# EAGLE design ATtiny LED badge (EAGLE 8.4.3)
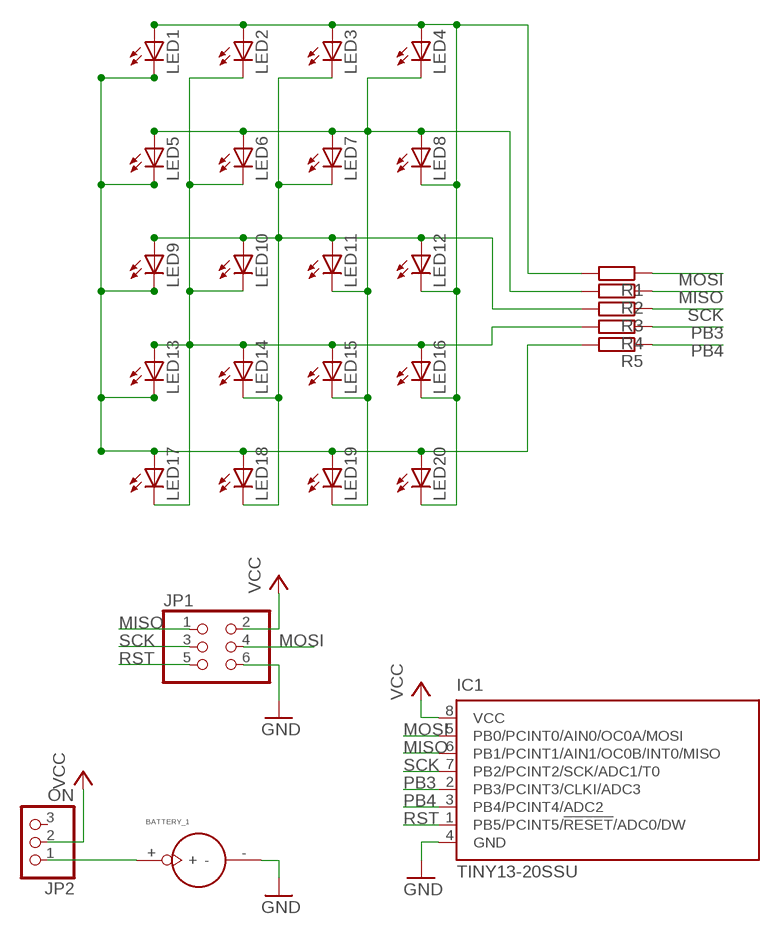
[diagram p0: schematic, sheet 1]

## Parts
BATTERY_1  BATTERY_1236_C  [BATTERY_1236_C]
IC1  TINY13-20SSU  [8S1]
JP1  PINHD-2X3  [2X03]
JP2  ON  PINHD-1X3  [1X03]
LED1  LED3MM  [LED3MM]
LED2  LED3MM  [LED3MM]
LED3  LED3MM  [LED3MM]
LED4  LED3MM  [LED3MM]
LED5  LED3MM  [LED3MM]
LED6  LED3MM  [LED3MM]
LED7  LED3MM  [LED3MM]
LED8  LED3MM  [LED3MM]
LED9  LED3MM  [LED3MM]
LED10  LED3MM  [LED3MM]
LED11  LED3MM  [LED3MM]
LED12  LED3MM  [LED3MM]
LED13  LED3MM  [LED3MM]
LED14  LED3MM  [LED3MM]
LED15  LED3MM  [LED3MM]
LED16  LED3MM  [LED3MM]
LED17  LED3MM  [LED3MM]
LED18  LED3MM  [LED3MM]
LED19  LED3MM  [LED3MM]
LED20  LED3MM  [LED3MM]
R1  R-EU_0207/7  [0207/7]
R2  R-EU_0207/7  [0207/7]
R3  R-EU_0207/7  [0207/7]
R4  R-EU_0207/7  [0207/7]
R5  R-EU_0207/7  [0207/7]

## Nets
GND: BATTERY_1.- IC1.4(GND) JP1.6
MISO: IC1.6(PB1/PCINT1/AIN1/OC0B/INT0/MISO) JP1.1 R2.1
MOSI: IC1.5(PB0/PCINT0/AIN0/OC0A/MOSI) JP1.4 R1.1
N$1: LED1.A LED2.A LED3.A LED4.A LED8.K(C) LED12.K(C) LED16.K(C) LED20.K(C) R1.2
N$2: LED4.K(C) LED5.A LED6.A LED7.A LED8.A LED11.K(C) LED15.K(C) LED19.K(C) R2.2
N$3: LED3.K(C) LED7.K(C) LED9.A LED10.A LED11.A LED12.A LED14.K(C) LED18.K(C) R3.2
N$4: LED2.K(C) LED6.K(C) LED10.K(C) LED13.A LED14.A LED15.A LED16.A LED17.K(C) R4.2
N$5: LED1.K(C) LED5.K(C) LED9.K(C) LED13.K(C) LED17.A LED18.A LED19.A LED20.A R5.2
N$6: BATTERY_1.+ JP2.1
PB3: IC1.2(PB3/PCINT3/CLKI/ADC3) R4.1
PB4: IC1.3(PB4/PCINT4/ADC2) R5.1
RST: IC1.1(PB5/PCINT5/!RESET!/ADC0/DW) JP1.5
SCK: IC1.7(PB2/PCINT2/SCK/ADC1/T0) JP1.3 R3.1
VCC: IC1.8(VCC) JP1.2 JP2.2
Unconnected: JP2.3

## Library data of the parts
BATTERY_1 = Itead_BP_110825.lbr:BATTERY_1236_C: SOC004
IC1 = atmel:TINY13: 8-bit AVR Microcontroller with 1K Bytes In-System Programmable Flash Source: http://www.atmel.com/dyn/resources/prod_documents/2535S.pdf; MPN: ATTINY13-20SSU; OC_FARNELL: 1455133; OC_NEWARK: 58M3771
JP1 = pinhead:PINHD-2X3: PIN HEADER
JP2 = pinhead:PINHD-1X3: PIN HEADER
LED1-LED20 = led:LED: LED OSRAM: - CHIPLED LG R971, LG N971, LY N971, LG Q971, LY Q971, LO R971, LY R971 LH N974, LH R974 LS Q976, LO Q976, LY Q976 LO Q996 - Hyper CHIPLED LW Q18S LB Q993, LB Q99A, LB R99A - SideLED LS A670, LO A670, LY A670, LG A670, LP A670 LB A673, LV A673, LT A673, LW A673 LH A674 LY A675 LS A676, LA A676, LO A676, LY A676, LW A676 LS A679, LY A679, LG A679 - Hyper Micro SIDELED® LS Y876, LA Y876, LO Y876, LY Y876 LT Y87S - SmartLED LW L88C, LW L88S LB L89C, LB L89S, LG L890 LS L89K, LO L89K, LY L89K LS L896, LA L896, LO L896, LY L896 - TOPLED LS T670, LO T670, LY T670, LG T670, LP T670 LSG T670, LSP T670, LSY T670, LOP T670, LYG T670 LG T671, LOG T671, LSG T671 LB T673, LV T673, LT T673, LW T673 LH T674 LS T676, LA T676, LO T676, LY T676, LB T676, LH T676, LSB T676, LW T676 LB T67C, LV T67C, LT T67C, LS T67K, LO T67K, LY T67K, LW E67C LS E67B, LA E67B, LO E67B, LY E67B, LB E67C, LV E67C, LT E67C LW T67C LS T679, LY T679, LG T679 LS T770, LO T770, LY T770, LG T770, LP T770 LB T773, LV T773, LT T773, LW T773 LH T774 LS E675, LA E675, LY E675, LS T675 LS T776, LA T776, LO T776, LY T776, LB T776 LHGB T686 LT T68C, LB T68C - Hyper Mini TOPLED® LB M676 - Mini TOPLED Santana® LG M470 LS M47K, LO M47K, LY M47K Source: http://www.osram.convergy.de LUXEON: - LUMILED® LXK2-PW12-R00, LXK2-PW12-S00, LXK2-PW14-U00, LXK2-PW14-V00 LXK2-PM12-R00, LXK2-PM12-S00, LXK2-PM14-U00 LXK2-PE12-Q00, LXK2-PE12-R00, LXK2-PE12-S00, LXK2-PE14-T00, LXK2-PE14-U00 LXK2-PB12-K00, LXK2-PB12-L00, LXK2-PB12-M00, LXK2-PB14-N00, LXK2-PB14-P00, LXK2-PB14-Q00 LXK2-PR12-L00, LXK2-PR12-M00, LXK2-PR14-Q00, LXK2-PR14-R00 LXK2-PD12-Q00, LXK2-PD12-R00, LXK2-PD12-S00 LXK2-PH12-R00, LXK2-PH12-S00 LXK2-PL12-P00, LXK2-PL12-Q00, LXK2-PL12-R00 Source: www.luxeon.com KINGBRIGHT: KA-3528ASYC Source: www.kingbright.com
R1-R5 = resistor:R-EU_: RESISTOR, European symbol

## Board
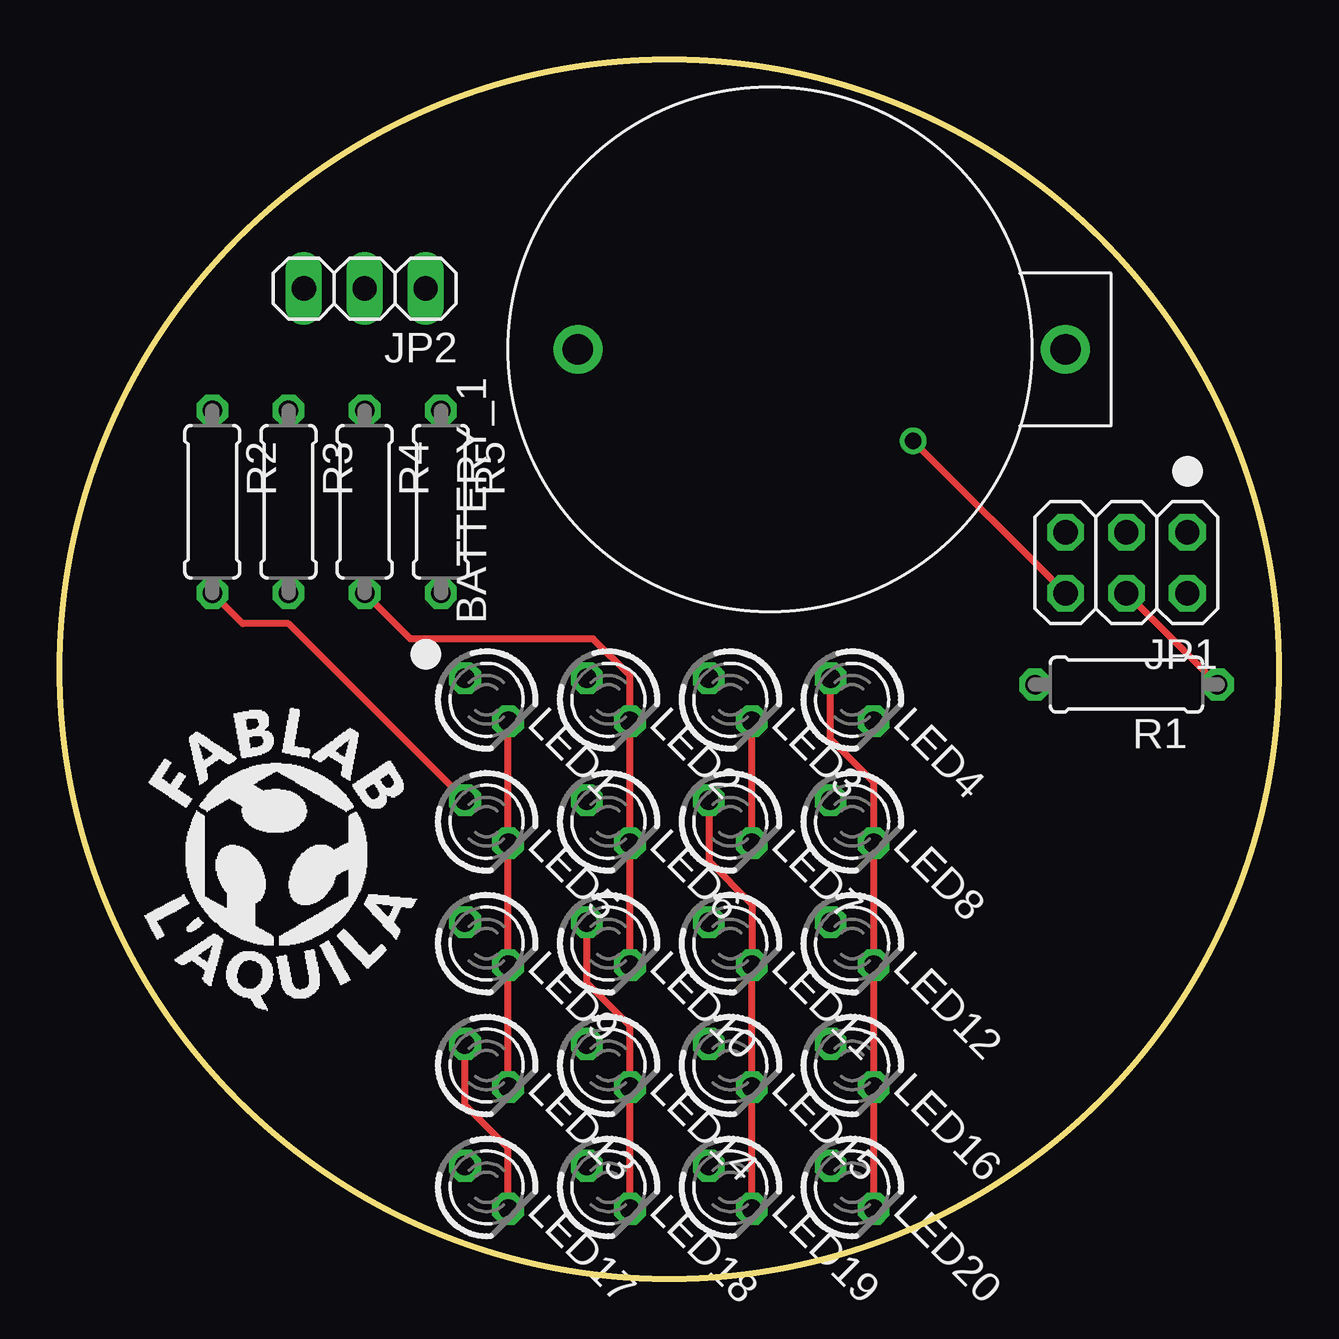
[diagram p1: board, top side]
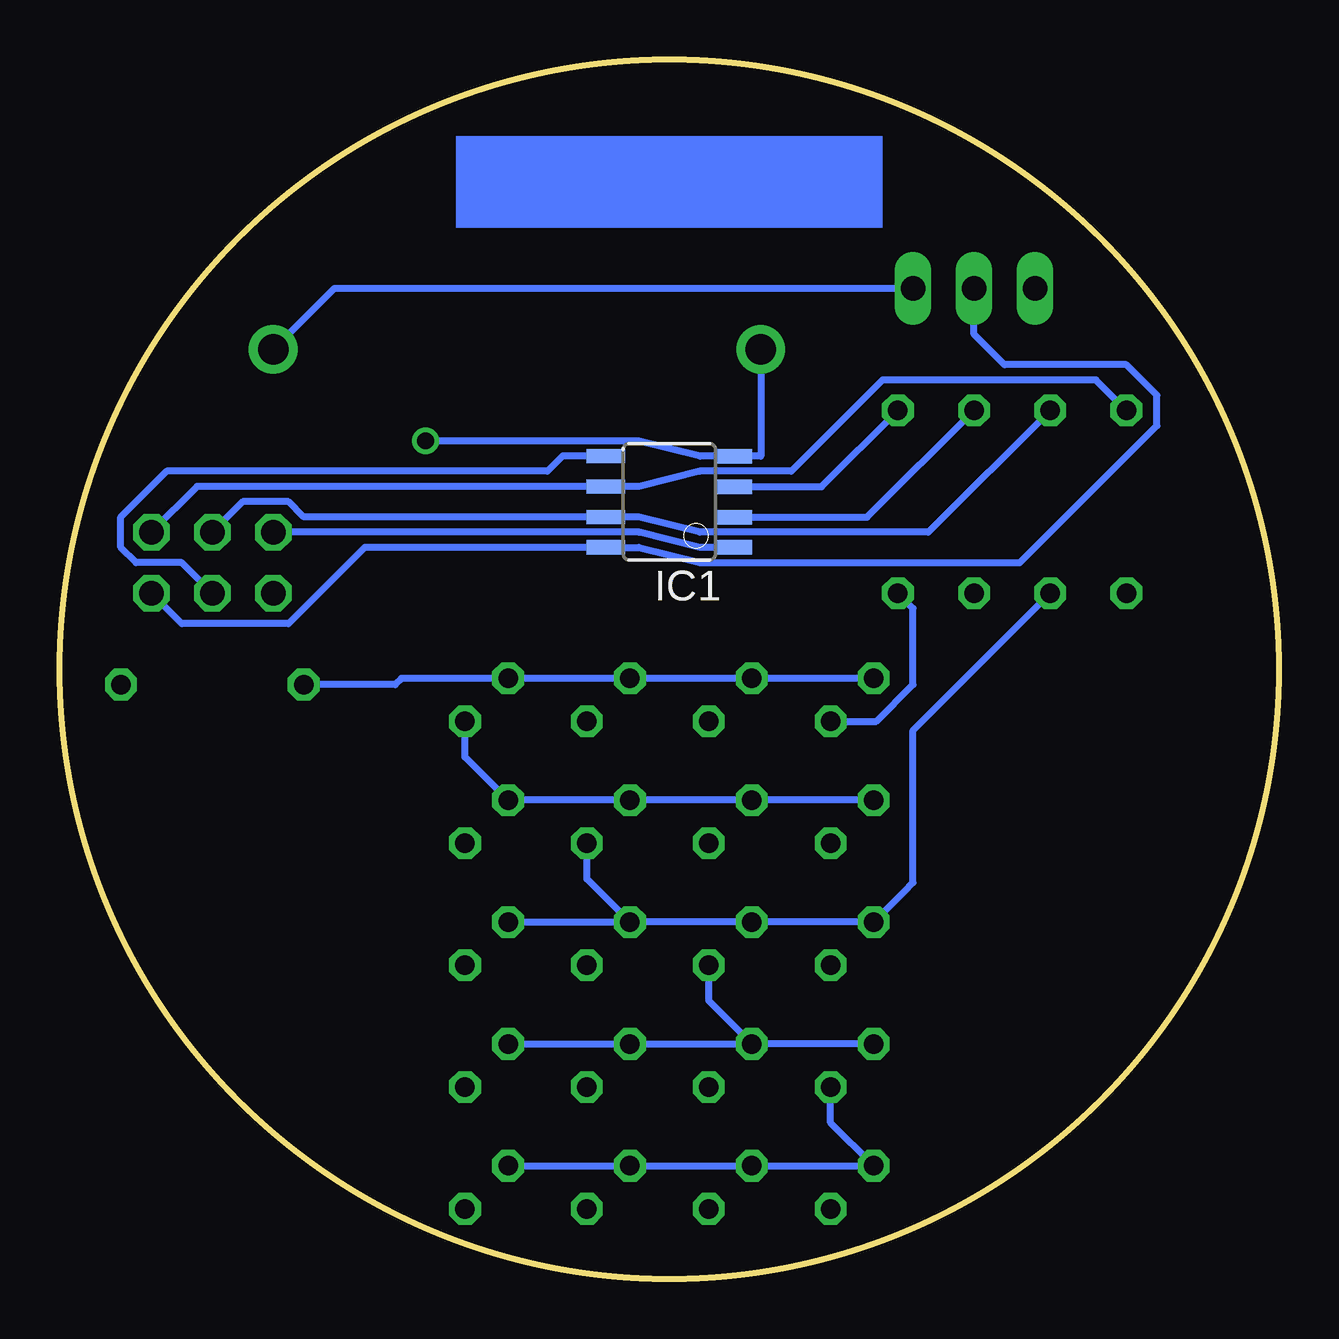
[diagram p2: board, bottom side, seen from below]

Size 50.8 x 50.8 mm. Coordinates in mm from the lower left corner, seen from the top.
Outline: circle at 25.4,25.4 radius 25.4
Copper layers (1*16): Top 0.035mm / dielectric 1.5mm / Bottom 0.035mm
Design rules "default": minimum track width 10mil, minimum drill 24mil, track to track 8mil, track to pad 8mil, pad to pad 8mil, via to via 8mil, smd to smd 8mil, copper to edge 40mil, drill to drill 8mil, minimum pad ring 10mil, minimum via ring 8mil, stop-mask expansion 4mil, vias tented up to drill 0mil, thermal gap 10mil

### Footprints (pad centres in the part's own frame; a part is rotated, then mirrored left to right if it is on the bottom)
BATTERY_1236_C = drill 1.27 pad 2.032: + 0,0; - 0,20.32
8S1 = smd 0.6 x 1.6: 1 -1.905,-2.654; 2 -0.645,-2.654; 3 0.625,-2.654; 4 1.895,-2.654; 5 1.905,2.654; 6 0.635,2.654; 7 -0.635,2.654; 8 -1.905,2.654
2X03 = drill 1.016 octagon: 1 -2.54,-1.27; 2 -2.54,1.27; 3 0,-1.27; 4 0,1.27; 5 2.54,-1.27; 6 2.54,1.27
1X03 = drill 1.016 long: 1 -2.54,0; 2 0,0; 3 2.54,0
LED3MM = drill 0.813 octagon: A -1.27,0; K 1.27,0
0207/7 = drill 0.813 octagon: 1 -3.81,0; 2 3.81,0

### Placement (x,y rotation side)
BATTERY_1  41.91,38.73 90 top
IC1  25.4,32.39 90 bottom
JP1  44.45,29.84 180 top
JP2  12.7,41.27 180 top
LED1  17.78,24.13 315 top
LED2  22.86,24.13 315 top
LED3  27.94,24.13 315 top
LED4  33.02,24.13 315 top
LED5  17.78,19.05 315 top
LED6  22.86,19.05 315 top
LED7  27.94,19.05 315 top
LED8  33.02,19.05 315 top
LED9  17.78,13.97 315 top
LED10  22.86,13.97 315 top
LED11  27.94,13.97 315 top
LED12  33.02,13.97 315 top
LED13  17.78,8.89 315 top
LED14  22.86,8.89 315 top
LED15  27.94,8.89 315 top
LED16  33.02,8.89 315 top
LED17  17.78,3.81 315 top
LED18  22.86,3.81 315 top
LED19  27.94,3.81 315 top
LED20  33.02,3.81 315 top
R1  44.45,24.76 180 top
R2  6.35,32.39 270 top
R3  9.53,32.39 270 top
R4  12.7,32.39 270 top
R5  15.88,32.39 270 top

### Tracks (layer width: path | path; a pad name or v marks a point on that pad's centre or on a via)
GND  (via drill 0.7)
  Top 0.3: v35.56,34.92 JP1.6
  Bottom 0.3: BATTERY_1.- 21.59,34.28 IC1.4 24.12,34.28 26.67,34.92 v35.56,34.92
MISO
  Bottom 0.3: R2.1 7.62,37.47 16.51,37.47 20.32,33.66 24.13,33.66 26.67,33.02 IC1.6 45.09,33.02 JP1.1
MOSI
  Top 0.3: R1.1 JP1.4
  Bottom 0.3: JP1.4 45.72,29.84 47.62,29.84 48.26,30.48 48.26,31.75 46.35,33.66 30.48,33.66 29.84,34.29 IC1.5
N$1
  Top 0.3: LED20.K LED16.K LED12.K LED8.K 33.92,20.69 32.12,22.49 LED4.A
  Bottom 0.3: LED1.A LED2.A LED3.A LED4.A 36.57,25.03 36.83,24.76 R1.2
N$2
  Top 0.3: LED19.K LED15.K LED11.K 28.84,15.61 27.04,17.41 LED7.A | LED5.A 9.53,27.3 7.62,27.3 R2.2
  Bottom 0.3: LED5.A LED6.A LED7.A LED8.A 33.92,21.74 LED4.K
N$3
  Top 0.3: LED7.K LED3.K | LED10.A 21.96,12.33 23.76,10.53 LED14.K LED18.K
  Bottom 0.3: LED11.A LED10.A LED9.A 15.61,16.14 15.24,16.51 15.24,22.86 R3.2 | LED11.A 28.84,16.66 LED7.K | LED12.A LED11.A
N$4
  Top 0.3: LED10.K LED6.K LED2.K 23.76,25.14 22.23,26.67 14.61,26.67 R4.2 | LED17.K 18.68,5.45 16.88,7.25 LED13.A
  Bottom 0.3: LED13.A LED14.A | LED14.A 23.76,11.58 LED10.K | LED16.A LED15.A LED14.A
N$5
  Top 0.3: LED13.K LED9.K LED5.K LED1.K
  Bottom 0.3: LED13.K 18.68,6.5 LED17.A LED18.A LED19.A LED20.A | LED1.K 16.77,23.23 15.24,24.76 15.24,27.94 R5.2
N$6
  Bottom 0.3: JP2.1 39.37,41.27 BATTERY_1.+
PB3
  Bottom 0.3: IC1.2 17.16,31.74 R4.1
PB4
  Bottom 0.3: IC1.3 19.06,33.01 R5.1
RST
  Bottom 0.3: IC1.1 24.13,30.48 26.67,31.11 JP1.5
SCK
  Bottom 0.3: R3.1 14.61,31.11 24.13,31.11 26.67,31.75 IC1.7 40.64,31.75 41.27,32.39 43.18,32.39 JP1.3
VCC
  Bottom 0.3: JP1.2 45.72,27.3 41.27,27.3 38.1,30.48 IC1.8 26.67,30.48 24.13,29.84 10.79,29.84 5.08,35.56 5.08,36.83 6.35,38.1 11.43,38.1 12.7,39.37 JP2.2
(copper drawn outside any net)
  shapes: Bottom area x1